# EAGLE schematic avr_usb_flash_drive_schematic (EAGLE 9.6.2)
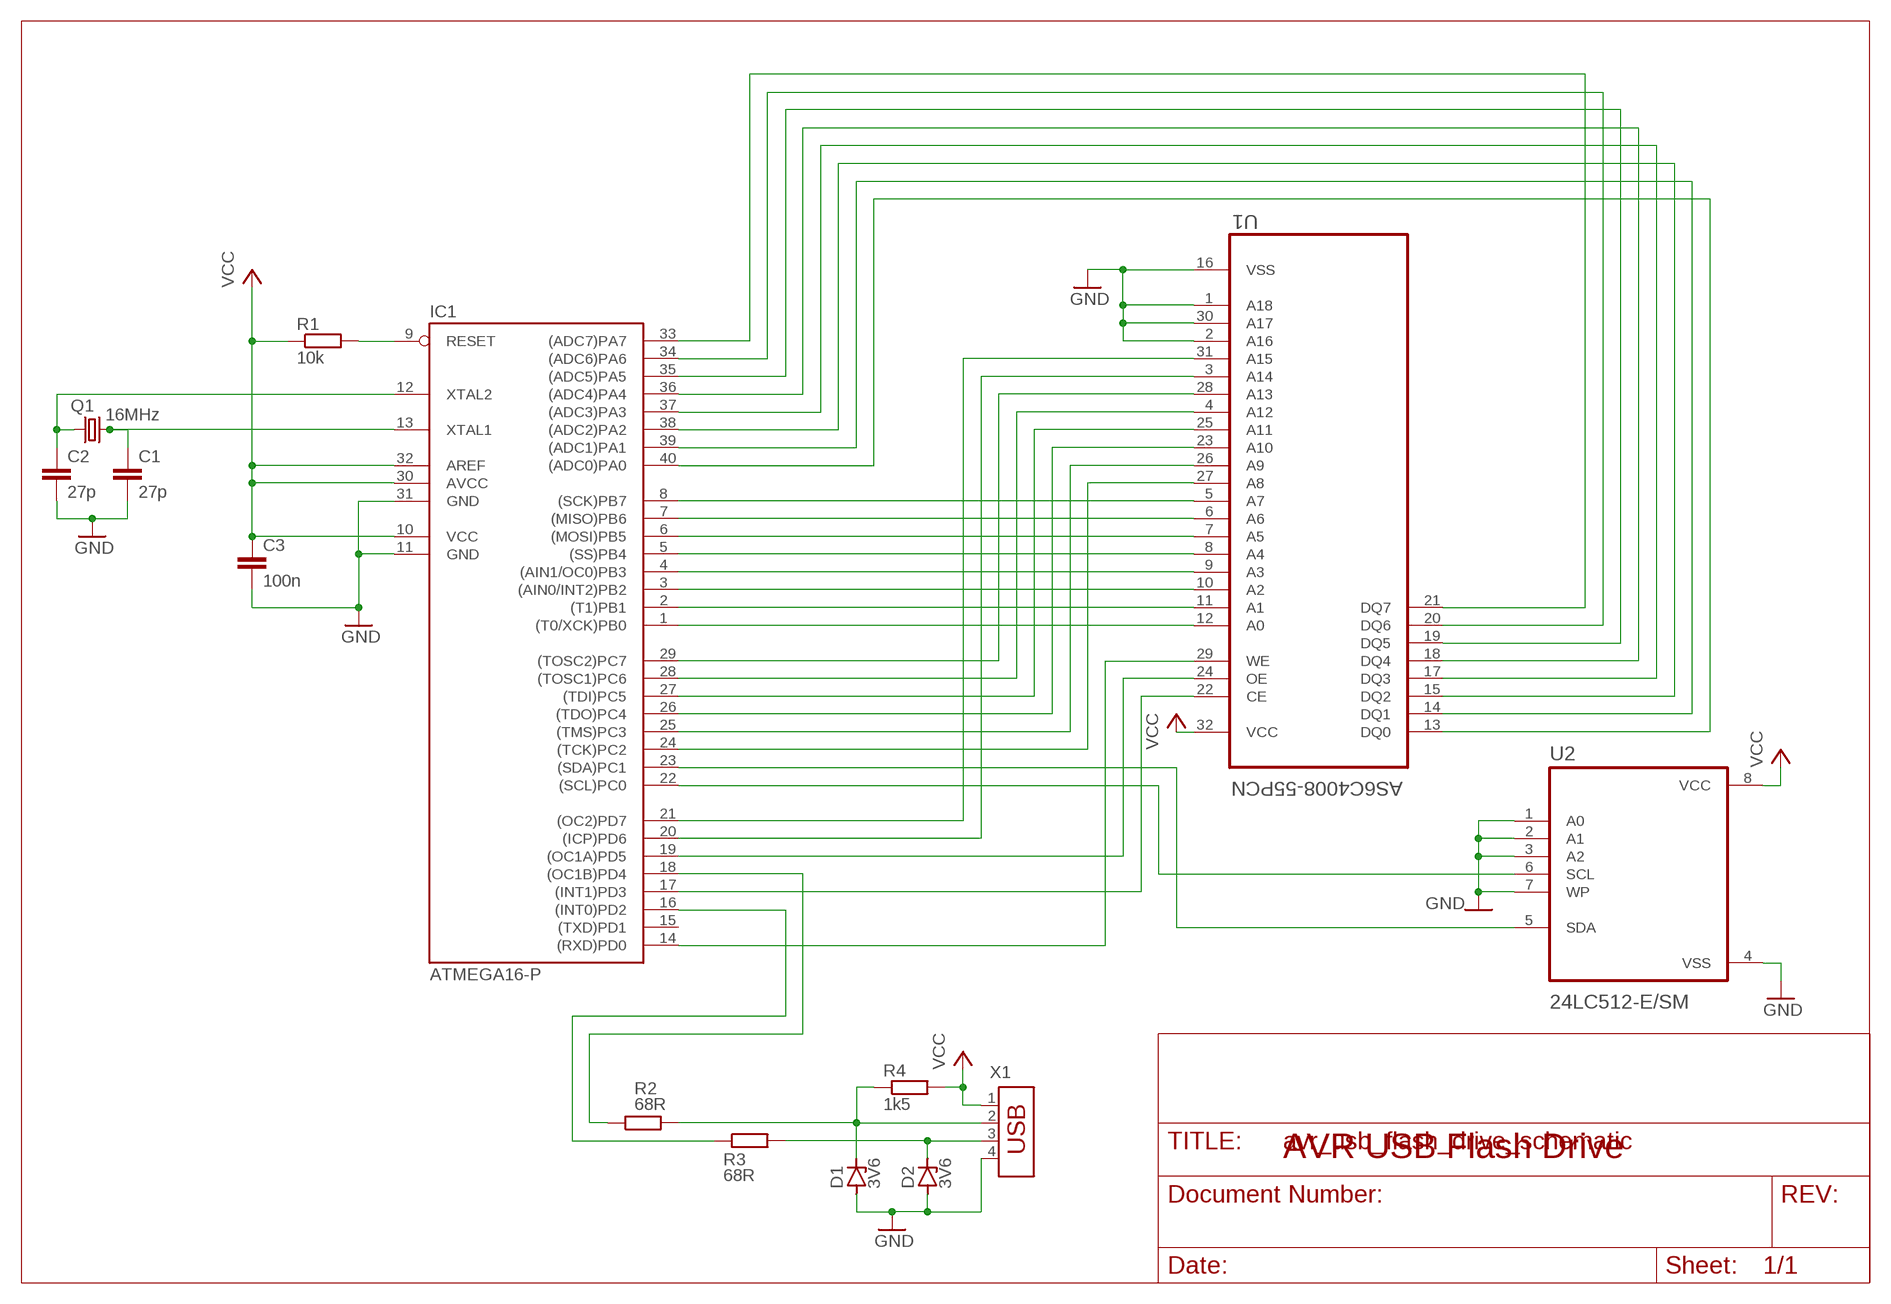
[diagram p0: schematic, sheet 1]

## Parts
C1  27p  C2.5/4  [C2.5-4]
C2  27p  C2.5/4  [C2.5-4]
C3  100n  C2.5/4  [C2.5-4]
D1  3V6  ZENER-DIODEDO35Z10  [DO35Z10]
D2  3V6  ZENER-DIODEDO35Z10  [DO35Z10]
IC1  ATMEGA16-P  MEGA16-P  [DIL40]
Q1  16MHz  CRYSTALHC49S  [HC49/S]
R1  10k  R-EU_0207/10  [0207/10]
R2  68R  R-EU_0207/10  [0207/10]
R3  68R  R-EU_0207/10  [0207/10]
R4  1k5  R-EU_0207/10  [0207/10]
U1  AS6C4008-55PCN  [DIP254P1524X393-32]
U2  24LC512-E/SM  [SOIC127P794X202-8N]
X1  USB-787616  [USB]

## Nets
GND: C1.2 C2.2 C3.2 D1.A D2.A IC1.11(GND) IC1.31(GND) U1.1(A18) U1.2(A16) U1.16(VSS) U1.30(A17) U2.1(A0) U2.2(A1) U2.3(A2) U2.4(VSS) U2.7(WP) X1.4
N$1: C1.1 IC1.13(XTAL1) Q1.1
N$2: IC1.9(RESET) R1.2
N$3: IC1.1((T0/XCK)PB0) U1.12(A0)
N$4: IC1.2((T1)PB1) U1.11(A1)
N$5: IC1.3((AIN0/INT2)PB2) U1.10(A2)
N$6: IC1.4((AIN1/OC0)PB3) U1.9(A3)
N$7: IC1.5((SS)PB4) U1.8(A4)
N$8: IC1.6((MOSI)PB5) U1.7(A5)
N$9: IC1.7((MISO)PB6) U1.6(A6)
N$10: IC1.8((SCK)PB7) U1.5(A7)
N$11: IC1.24((TCK)PC2) U1.27(A8)
N$12: IC1.25((TMS)PC3) U1.26(A9)
N$13: IC1.26((TDO)PC4) U1.23(A10)
N$14: IC1.27((TDI)PC5) U1.25(A11)
N$15: IC1.28((TOSC1)PC6) U1.4(A12)
N$16: IC1.29((TOSC2)PC7) U1.28(A13)
N$17: IC1.20((ICP)PD6) U1.3(A14)
N$18: IC1.21((OC2)PD7) U1.31(A15)
N$19: IC1.40((ADC0)PA0) U1.13(DQ0)
N$20: IC1.39((ADC1)PA1) U1.14(DQ1)
N$21: IC1.38((ADC2)PA2) U1.15(DQ2)
N$22: IC1.37((ADC3)PA3) U1.17(DQ3)
N$23: IC1.36((ADC4)PA4) U1.18(DQ4)
N$24: IC1.35((ADC5)PA5) U1.19(DQ5)
N$25: IC1.34((ADC6)PA6) U1.20(DQ6)
N$26: IC1.33((ADC7)PA7) U1.21(DQ7)
N$27: IC1.14((RXD)PD0) U1.29(WE)
N$28: IC1.19((OC1A)PD5) U1.24(OE)
N$29: IC1.17((INT1)PD3) U1.22(CE)
N$30: D1.C R2.2 R4.1 X1.2
N$31: IC1.22((SCL)PC0) U2.6(SCL)
N$32: IC1.23((SDA)PC1) U2.5(SDA)
N$33: C2.1 IC1.12(XTAL2) Q1.2
N$34: IC1.18((OC1B)PD4) R2.1
N$35: D2.C R3.2 X1.3
N$36: IC1.16((INT0)PD2) R3.1
VCC: C3.1 IC1.10(VCC) IC1.30(AVCC) IC1.32(AREF) R1.1 R4.2 U1.32(VCC) U2.8(VCC) X1.1
Unconnected: IC1.15((TXD)PD1)

## Notes on the sheet
- AVR USB Flash Drive

## Library data of the parts
C1-C3 = capacitor-wima:C: CAPACITOR naming: grid - package width
D1 D2 = diode:ZENER-DIODE: Z-Diode
IC1 = atmel:MEGA16-P: MICROCONTROLLER 16 Kbytes FLASH 1 kbytes SRAM 512 bytes EEPROM USART 8-channel 10 bit ADC Source: avr.lbr; MPN: ATMEGA16-16PU; OC_FARNELL: 9171142; OC_NEWARK: 01M6885
Q1 = crystal:CRYSTAL: CRYSTAL; OC_FARNELL: 1667008; OC_NEWARK: unknown
R1-R4 = rcl:R-EU_: RESISTOR, European symbol; SPICEPREFIX: R
U1 = Alliance_Memory_By_element14_Batch_1:AS6C4008-55PCN: CMOS SRAM; MPN: AS6C4008-55PCN; OC_FARNELL: 1562900; OC_NEWARK: 94M6217; PACKAGE: DIP-32; SUPPLIER: ALLIANCE MEMORY
U2 = 24LC512-E_SM:24LC512-E/SM: Check prices <https://pricing.snapeda.com/parts/24LC512-E/SM/Microchip/view-part?ref=eda>; AVAILABILITY: Good; DESCRIPTION: EEPROM Memory IC 512Kb (64K x 8) I²C 400kHz 900ns 8-SOIJ; MF: Microchip; MP: 24LC512-E/SM; PACKAGE: SOIC-8 Microchip Technology; PRICE: None; PURCHASE-URL: https://pricing.snapeda.com/search/part/24LC512-E/SM/?ref=eda
X1 = con-amp:USB-787616: AMP connector